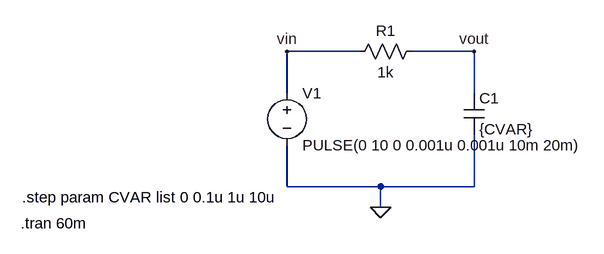
[diagram p0: schematic 2_Zadatak_lab2.asc]
2_Zadatak_lab2.asc, the LTspice schematic file:
Version 4
SHEET 1 880 680
WIRE 128 96 16 96
WIRE 304 96 208 96
WIRE 16 160 16 96
WIRE 304 160 304 96
WIRE 16 304 16 240
WIRE 160 304 16 304
WIRE 304 304 304 224
WIRE 304 304 160 304
WIRE 160 336 160 304
FLAG 160 336 0
FLAG 16 96 vin
FLAG 304 96 vout
SYMBOL res 224 80 R90
WINDOW 0 0 56 VBottom 2
WINDOW 3 32 56 VTop 2
SYMATTR InstName R1
SYMATTR Value 1k
SYMBOL cap 288 160 R0
SYMATTR InstName C1
SYMATTR Value {CVAR}
SYMBOL voltage 16 144 R0
WINDOW 123 0 0 Left 0
WINDOW 39 0 0 Left 0
SYMATTR InstName V1
SYMATTR Value PULSE(0 10 0 0.001u 0.001u 10m 20m)
TEXT -392 320 Left 2 !.step param CVAR list 0 0.1u 1u 10u
TEXT -394 360 Left 2 !.tran 60m

The netlist it stands for:
* 2_Zadatak_lab2.asc
R1 vout vin 1k
C1 vout 0 {CVAR}
V1 vin 0 PULSE(0 10 0 0.001u 0.001u 10m 20m)
.step param CVAR list 0 0.1u 1u 10u
.tran 60m
.backanno
.end

* Results of the author's LTspice run, read from the files saved beside the schematic
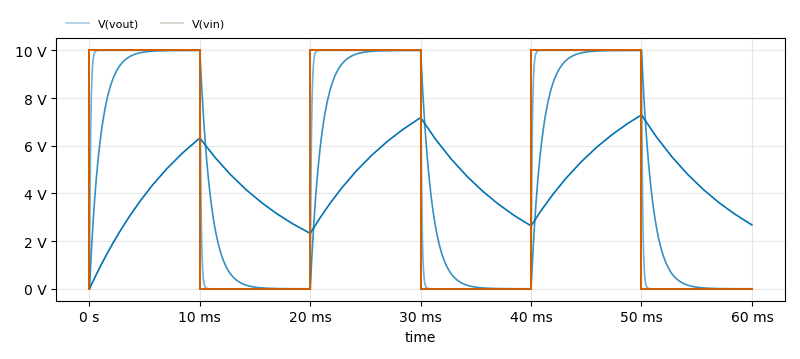
[diagram p1: Transient Analysis of 2_Zadatak_lab2.asc, plotted from the saved traces]
* Transient Analysis, 4 runs:
*   V(vout) [cvar=0]: min 0 V, max 10 V, average 5 V, rms 7.071 V, last 0 V
*   V(vout) [cvar=1e-007]: min 0 V, max 10 V, average 4.999 V, rms 7.035 V, last 0 V
*   V(vout) [cvar=1e-006]: min 0 V, max 10 V, average 5 V, rms 6.709 V, last 452.7 µV
*   V(vout) [cvar=1e-005]: min 0 V, max 7.292 V, average 4.554 V, rms 4.806 V, last 2.683 V
*   V(vin) [cvar=0]: min 0 V, max 10 V, average 5 V, rms 7.071 V, last 0 V
*   V(vin) [cvar=1e-007]: min 0 V, max 10 V, average 5 V, rms 7.071 V, last 0 V
*   V(vin) [cvar=1e-006]: min 0 V, max 10 V, average 5 V, rms 7.071 V, last 0 V
*   V(vin) [cvar=1e-005]: min 0 V, max 10 V, average 5 V, rms 7.071 V, last 0 V